# Altium schematic sheet Master track2.SchDoc: GPS tracker with AX.25 radio modem
size A4; Author: I.Ivanov; CompanyName: TU-Sofia; DrawnBy: Eng. I. Ivanov; Engineer: I.Ivanov; Organization: TU-Sofia; SheetNumber: 0; SheetTotal: 3
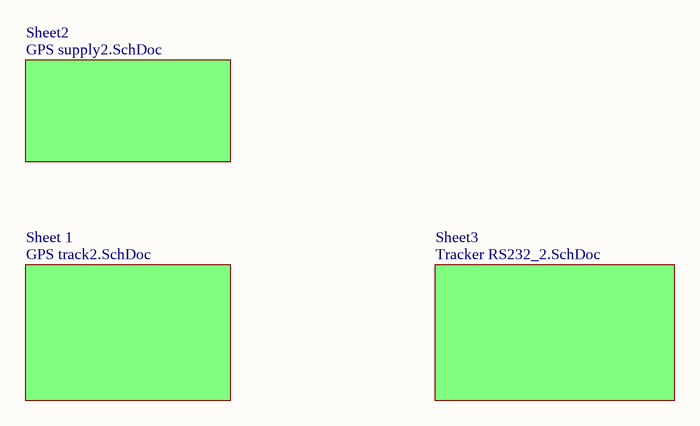
[diagram p0: Master track2.SchDoc]

## Sub-sheets
Sheet2 = GPS supply2.SchDoc: no entries
Sheet3 = Tracker RS232_2.SchDoc: no entries
Sheet 1 = GPS track2.SchDoc: no entries